# EAGLE design mainbrd (EAGLE 8.1.0)
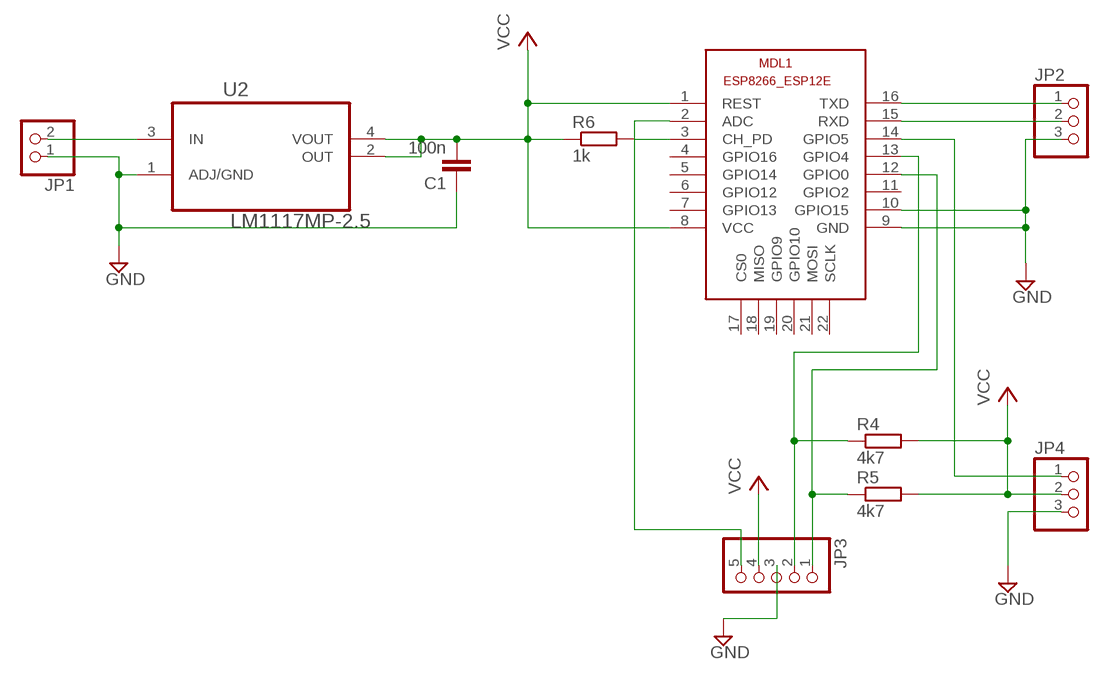
[diagram p0: schematic, sheet 1]

## Parts
C1  100n  C-EUC0805  [C0805]
JP1  PINHD-1X2  [1X02]
JP2  PINHD-1X3  [1X03]
JP3  PINHD-1X5  [1X05]
JP4  PINHD-1X3  [1X03]
MDL1  ESP8266-12EESP8266-ESP12E  [ESP8266-ESP12E]
R4  4k7  R-EU_R0805  [R0805]
R5  4k7  R-EU_R0805  [R0805]
R6  1k  R-EU_R0805  [R0805]
U2  LM1117MP-2.5  [SOT230P696X180-4N]

## Nets
GND: C1.1 JP1.1 JP2.3 JP3.3 JP4.3 MDL1.9(GND) MDL1.10(GPIO15) U2.1(ADJ/GND)
N$1: JP2.1 MDL1.16(TXD)
N$2: JP2.2 MDL1.15(RXD)
N$4: MDL1.3(CH_PD) R6.2
N$5: JP1.2 U2.3(IN)
N$7: JP3.1 MDL1.12(GPIO0) R5.1
N$8: JP3.2 MDL1.13(GPIO4) R4.1
N$9: JP3.5 MDL1.2(ADC)
N$11: JP4.1 MDL1.14(GPIO5)
VCC: C1.2 JP3.4 JP4.2 MDL1.1(REST) MDL1.8(VCC) R4.2 R5.2 R6.1 U2.2(OUT) U2.4(VOUT)
Unconnected: MDL1.4(GPIO16) MDL1.5(GPIO14) MDL1.6(GPIO12) MDL1.7(GPIO13) MDL1.11(GPIO2) MDL1.17(CS0) MDL1.18(MISO) MDL1.19(GPIO9) MDL1.20(GPIO10) MDL1.21(MOSI) MDL1.22(SCLK)

## Library data of the parts
C1 = resistor:C-EU: CAPACITOR, European symbol
JP1 = pinhead:PINHD-1X2: PIN HEADER
JP2 JP4 = pinhead:PINHD-1X3: PIN HEADER
JP3 = pinhead:PINHD-1X5: PIN HEADER
MDL1 = ESP8266-ESP12E:ESP8266-12E: ESP8266-12E with additional I/O and GPIO04/05 corrected The author cannot warrant that this library is free from error or will meet your specific requirements. Created by PuceBaboon.com. Komagane, Nagano, JAPAN
R4-R6 = resistor:R-EU_: RESISTOR, European symbol
U2 = esp_adapter:LM1117MP-2.5: Linear regulators; MPN: LM1117MP-2.5; OC_FARNELL: 9779205; OC_NEWARK: 41K3468; PACKAGE: SOT223-3; SUPPLIER: NationalSemiconductor

## Board
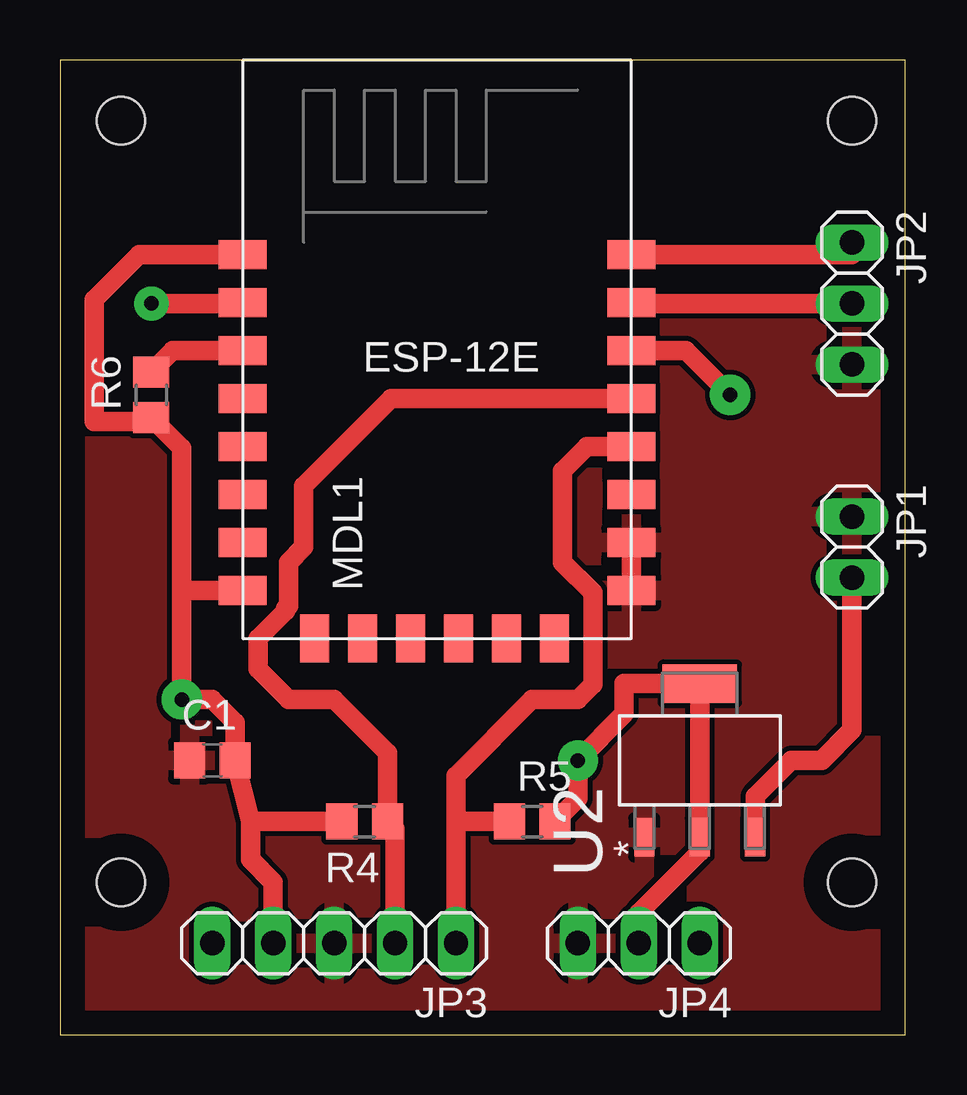
[diagram p1: board, top side]
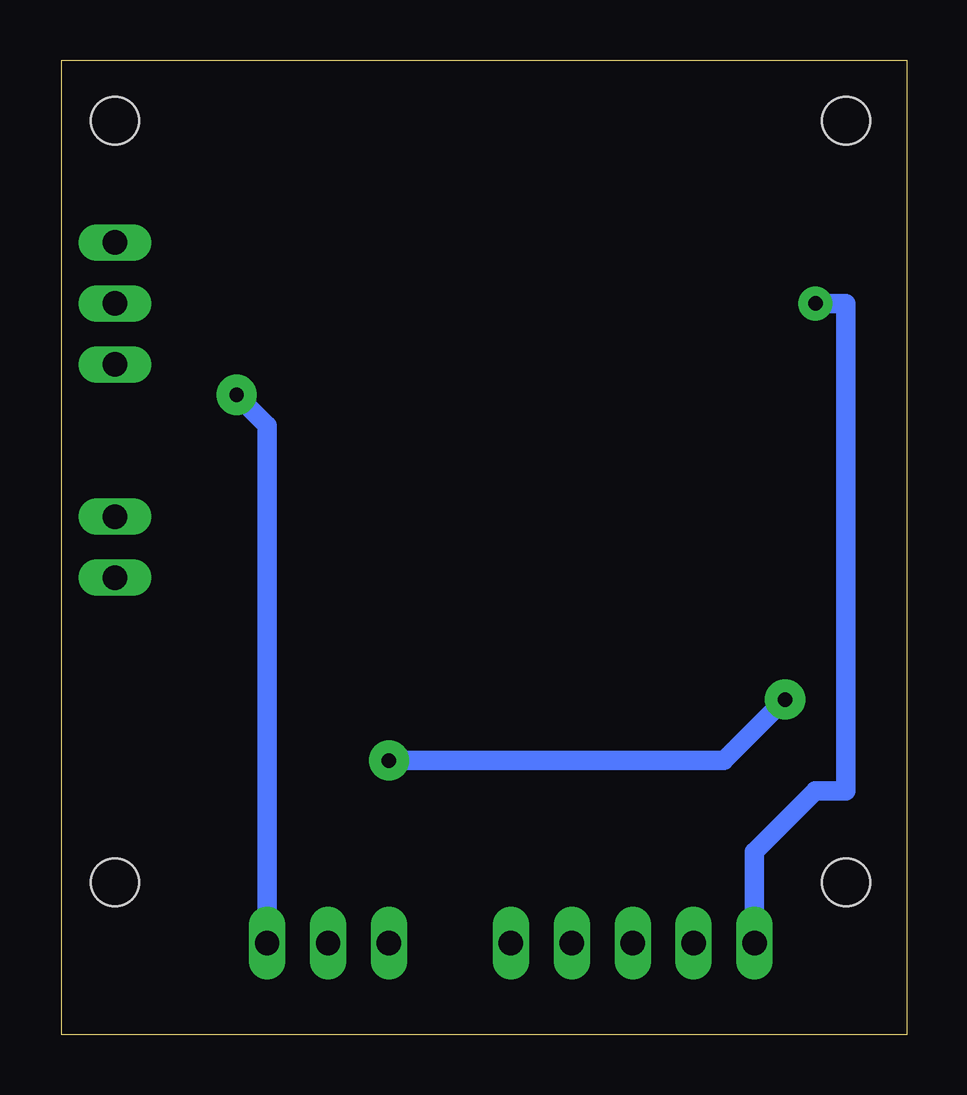
[diagram p2: board, bottom side, seen from below]

Size 35.23 x 40.63 mm. Coordinates in mm from the lower left corner, seen from the top.
Outline: 0,0 35.23,0 35.23,40.63 0,40.63 0,0
Copper layers (1*16): Top 0.035mm / dielectric 1.5mm / Bottom 0.035mm
Design rules "default": minimum track width 10mil, minimum drill 24mil, track to track 8mil, track to pad 8mil, pad to pad 8mil, via to via 8mil, smd to smd 8mil, copper to edge 40mil, drill to drill 8mil, minimum pad ring 10mil, minimum via ring 8mil, stop-mask expansion 4mil, vias tented up to drill 0mil, thermal gap 10mil
Holes 2 mm at 2.54,38.1 2.54,6.35 33.02,38.1 33.02,6.35

### Footprints (pad centres in the part's own frame; a part is rotated, then mirrored left to right if it is on the bottom)
C0805 = smd 1.3 x 1.5: 1 -0.95,0; 2 0.95,0
1X02 = drill 1.016 long: 1 -1.27,0; 2 1.27,0
1X03 = drill 1.016 long: 1 -2.54,0; 2 0,0; 3 2.54,0
1X05 = drill 1.016 long: 1 -5.08,0; 2 -2.54,0; 3 0,0; 4 2.54,0; 5 5.08,0
ESP8266-ESP12E = smd 2 x 1.2: 1 0,16; 2 0,14; 3 0,12; 4 0,10; 5 0,8; 6 0,6; 7 0,4; 8 0,2; 9 16.2,2; 10 16.2,4; 11 16.2,6; 12 16.2,8; 13 16.2,10; 14 16.2,12; 15 16.2,14; 16 16.2,16 | smd 1.2 x 2: 17 3,0; 18 5,0; 19 7,0; 20 9,0; 21 11,0; 22 13,0
R0805 = smd 1.3 x 1.5: 1 -0.95,0; 2 0.95,0
SOT230P696X180-4N = smd 1.6 x 0.838: 1 -3.2,2.311; 2 -3.2,0; 3 -3.2,-2.311 | smd 1.6 x 3.099: 4 3.2,0

### Placement (x,y rotation side)
C1  6.35,11.43 0 top
JP1  33.02,20.32 270 top
JP2  33.02,30.48 270 top
JP3  11.43,3.81 180 top
JP4  24.13,3.81 180 top
MDL1  7.62,16.51 0 top
R4  12.7,8.89 180 top
R5  19.68,8.89 0 top
R6  3.81,26.67 90 top
U2  26.67,11.43 90 top

### Tracks (layer width: path | path; a pad name or v marks a point on that pad's centre or on a via)
GND
  Top 0.813: MDL1.10 MDL1.9
  pour Top: 0,40.64 35.56,40.64 35.56,0 0,0
N$1
  Top 0.813: MDL1.16 33.02,32.51 JP2.1
N$2
  Top 0.813: JP2.2 23.85,30.48 MDL1.15
N$4
  Top 0.813: MDL1.3 4.7,28.51 R6.2
N$5
  Top 0.813: U2.3 28.98,9.93 30.48,11.43 31.75,11.43 33.02,12.7 JP1.2
N$7
  Top 0.813: MDL1.12 21.97,24.51 20.95,23.5 20.95,19.68 22.21,18.43 22.21,14.59 21.59,13.97 19.68,13.97 16.51,10.79 16.51,8.89 | 16.51,8.89 JP3.1 | R5.1 16.51,8.89
N$8
  Top 0.813: JP3.2 13.97,8.57 R4.1 13.65,11.75 11.43,13.97 9.53,13.97 8.26,15.24 8.26,16.51 9.41,17.66 9.41,17.76 9.53,17.88 9.53,19.68 10.16,20.32 10.16,22.86 13.81,26.51 MDL1.13
N$9  (via drill 0.6 pad 1.42)
  Top 0.813: MDL1.2 7.62,30.48 v3.81,30.48
  Bottom 0.813: v3.81,30.48 2.54,30.48 2.54,10.16 3.81,10.16 6.35,7.62 JP3.5
N$11  (via drill 0.6 pad 1.68)
  Top 0.813: MDL1.14 26.1,28.51 v27.94,26.67
  Bottom 0.813: JP4.1 26.67,25.4 v27.94,26.67
VCC  (via drill 0.6 pad 1.68)
  Top 0.813: MDL1.1 3.3,32.51 1.42,30.63 1.42,25.55 3.64,25.55 R6.1 5.08,24.45 5.08,18.51 | 5.08,18.51 v5.08,13.97 6.35,13.97 7.3,13.02 C1.2 7.94,8.89 | 5.08,18.51 MDL1.8 | 7.94,8.89 7.94,7.3 8.89,6.35 JP3.4 | JP4.2 24.13,5.08 26.67,7.62 U2.2 U2.4 23.52,14.63 23.52,13.36 v21.59,11.43 21.59,9.85 R5.2 | 7.94,8.89 R4.2
  Bottom 0.813: v21.59,11.43 7.62,11.43 v5.08,13.97